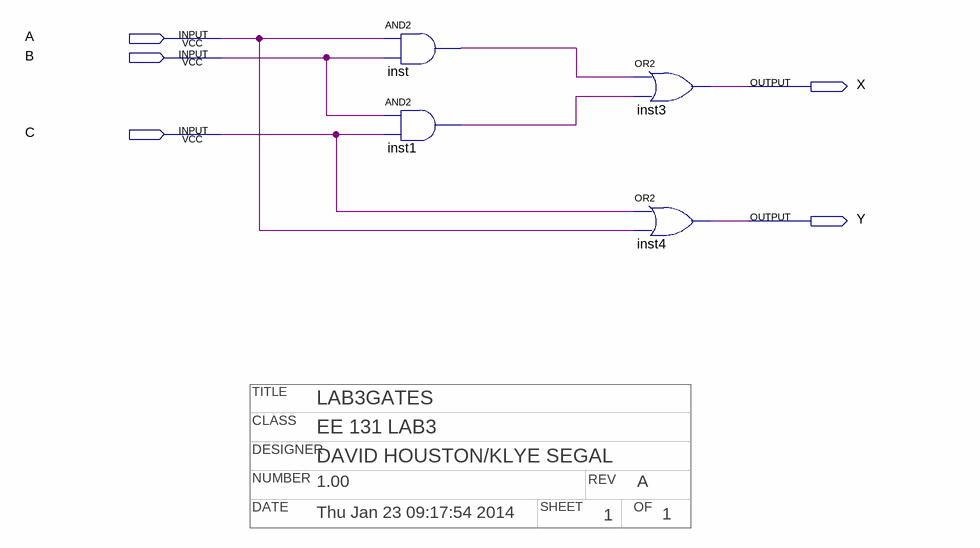
[diagram p0: schematic sheet]
// Quartus schematic LAB3GATES.bdf as structural Verilog: 4 symbols, 5 pins
// Title block: TITLE: LAB3GATES; CLASS: EE 131 LAB3; DESIGNER: DAVID HOUSTON/KLYE SEGAL; NUMBER: 1.00; REV: A; DATE: Thu Jan 23 09:17:54 2014; SHEET: 1; OF: 1
module LAB3GATES (
  input  A,
  input  B,
  input  C,
  output X,
  output Y
);

  wire inst1_out, inst_out;

  and inst (inst_out, A, B);
  and inst1 (inst1_out, B, C);
  or inst3 (X, inst_out, inst1_out);
  or inst4 (Y, C, A);
endmodule
